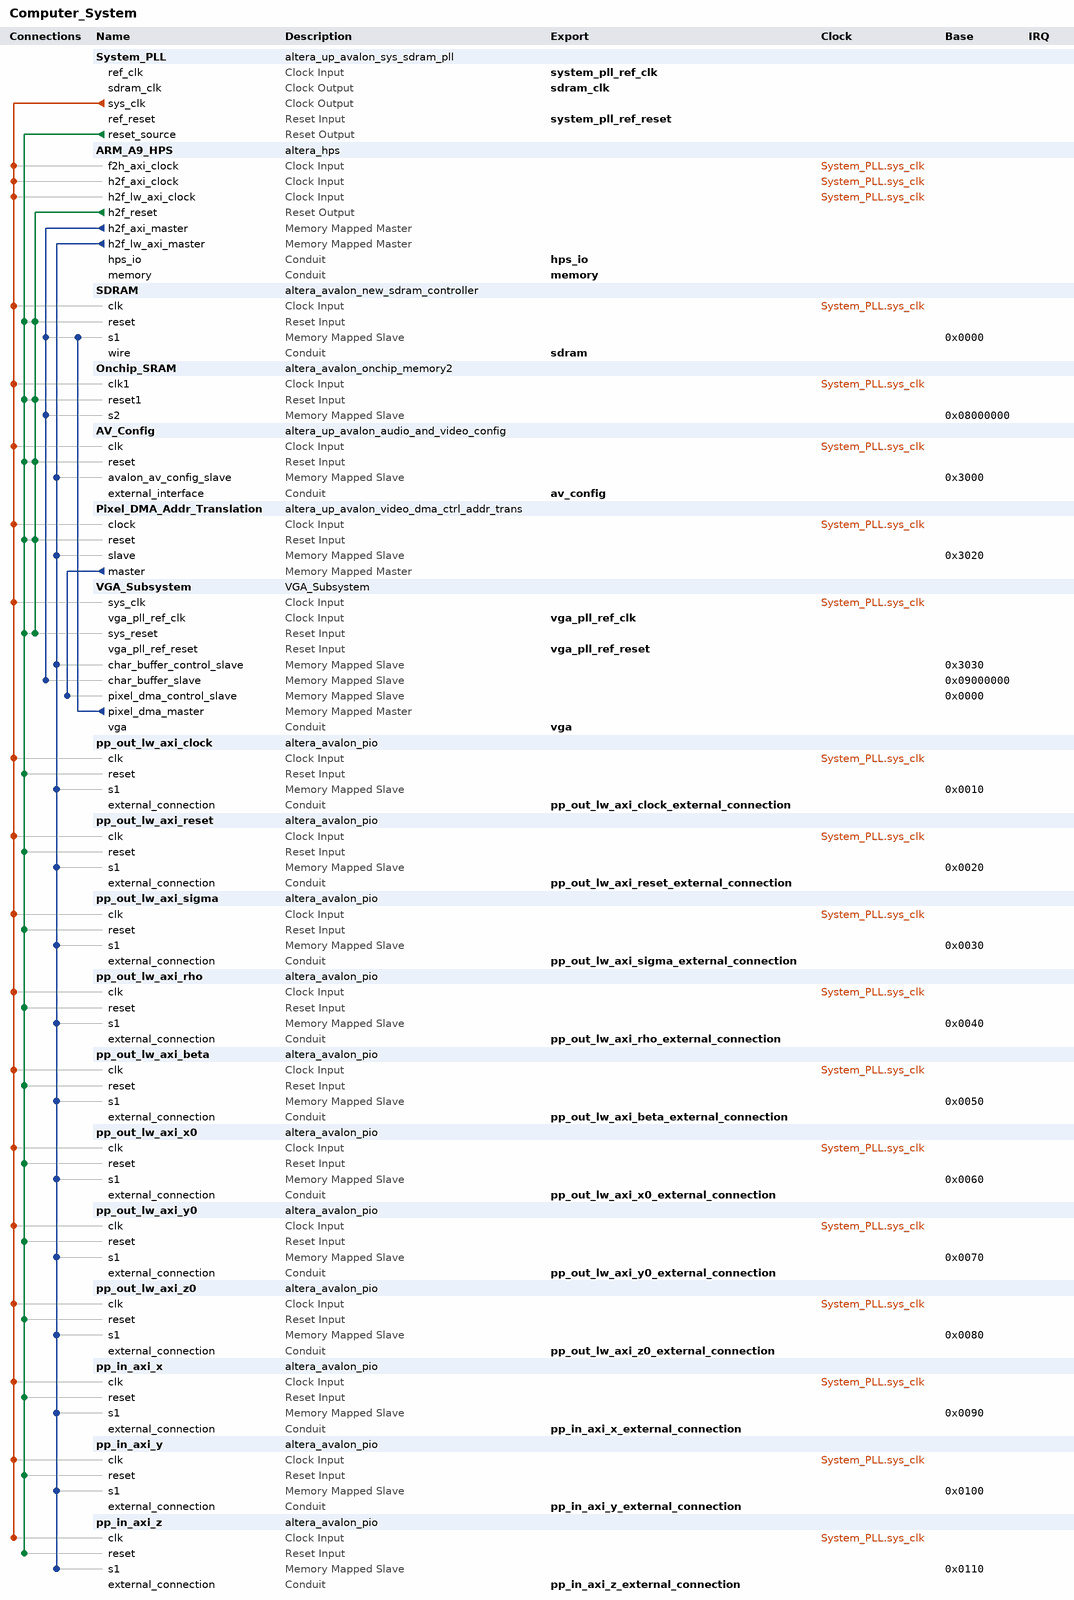
[diagram p0: system contents]
# Platform Designer (Qsys) system Computer_System, Cyclone V 5CSEMA5F31C6
# Parameters at their usual value, and those the tool derives, are not listed.
package require -exact qsys 18.1
create_system Computer_System
set_project_property DEVICE_FAMILY {Cyclone V}
set_project_property DEVICE 5CSEMA5F31C6

add_instance System_PLL altera_up_avalon_sys_sdram_pll 18.0
set_instance_parameter_value System_PLL CV_boards DE1-SoC
set_instance_parameter_value System_PLL gui_outclk 100.0
set_instance_parameter_value System_PLL gui_refclk 50.0

add_instance ARM_A9_HPS altera_hps 18.1
set_instance_parameter_value ARM_A9_HPS EMAC1_Mode RGMII
set_instance_parameter_value ARM_A9_HPS EMAC1_PinMuxing {HPS I/O Set 0}
set_instance_parameter_value ARM_A9_HPS F2SCLK_COLDRST_Enable false
set_instance_parameter_value ARM_A9_HPS F2SCLK_DBGRST_Enable false
set_instance_parameter_value ARM_A9_HPS F2SCLK_WARMRST_Enable false
set_instance_parameter_value ARM_A9_HPS F2SINTERRUPT_Enable true
set_instance_parameter_value ARM_A9_HPS F2S_Width 2
set_instance_parameter_value ARM_A9_HPS FPGA_PERIPHERAL_OUTPUT_CLOCK_FREQ_EMAC0_GTX_CLK 125
set_instance_parameter_value ARM_A9_HPS FPGA_PERIPHERAL_OUTPUT_CLOCK_FREQ_EMAC0_MD_CLK 100.0
set_instance_parameter_value ARM_A9_HPS FPGA_PERIPHERAL_OUTPUT_CLOCK_FREQ_EMAC1_GTX_CLK 125
set_instance_parameter_value ARM_A9_HPS FPGA_PERIPHERAL_OUTPUT_CLOCK_FREQ_EMAC1_MD_CLK 100.0
set_instance_parameter_value ARM_A9_HPS HPS_PROTOCOL DDR3
set_instance_parameter_value ARM_A9_HPS I2C0_Mode I2C
set_instance_parameter_value ARM_A9_HPS I2C0_PinMuxing {HPS I/O Set 0}
set_instance_parameter_value ARM_A9_HPS I2C1_Mode I2C
set_instance_parameter_value ARM_A9_HPS I2C1_PinMuxing {HPS I/O Set 0}
set_instance_parameter_value ARM_A9_HPS LWH2F_Enable true
set_instance_parameter_value ARM_A9_HPS MEM_BANKADDR_WIDTH 3
set_instance_parameter_value ARM_A9_HPS MEM_CLK_FREQ 400.0
set_instance_parameter_value ARM_A9_HPS MEM_COL_ADDR_WIDTH 10
set_instance_parameter_value ARM_A9_HPS MEM_DQ_WIDTH 32
set_instance_parameter_value ARM_A9_HPS MEM_DRV_STR RZQ/7
set_instance_parameter_value ARM_A9_HPS MEM_ROW_ADDR_WIDTH 15
set_instance_parameter_value ARM_A9_HPS MEM_RTT_NOM RZQ/4
set_instance_parameter_value ARM_A9_HPS MEM_RTT_WR RZQ/4
set_instance_parameter_value ARM_A9_HPS MEM_TCL 11
set_instance_parameter_value ARM_A9_HPS MEM_TFAW_NS 30.0
set_instance_parameter_value ARM_A9_HPS MEM_TRAS_NS 35.0
set_instance_parameter_value ARM_A9_HPS MEM_TRCD_NS 13.75
set_instance_parameter_value ARM_A9_HPS MEM_TRFC_NS 260.0
set_instance_parameter_value ARM_A9_HPS MEM_TRP_NS 13.75
set_instance_parameter_value ARM_A9_HPS MEM_VENDOR JEDEC
set_instance_parameter_value ARM_A9_HPS MEM_WTCL 8
set_instance_parameter_value ARM_A9_HPS QSPI_Mode {1 SS}
set_instance_parameter_value ARM_A9_HPS QSPI_PinMuxing {HPS I/O Set 0}
set_instance_parameter_value ARM_A9_HPS REF_CLK_FREQ 25.0
set_instance_parameter_value ARM_A9_HPS S2FCLK_USER2CLK 5
set_instance_parameter_value ARM_A9_HPS S2F_Width 3
set_instance_parameter_value ARM_A9_HPS SDIO_Mode {4-bit Data}
set_instance_parameter_value ARM_A9_HPS SDIO_PinMuxing {HPS I/O Set 0}
set_instance_parameter_value ARM_A9_HPS SPIM1_Mode {Single Slave Select}
set_instance_parameter_value ARM_A9_HPS SPIM1_PinMuxing {HPS I/O Set 0}
set_instance_parameter_value ARM_A9_HPS STM_Enable false
set_instance_parameter_value ARM_A9_HPS TIMING_BOARD_AC_SKEW 0.03
set_instance_parameter_value ARM_A9_HPS TIMING_BOARD_AC_TO_CK_SKEW 0.0
set_instance_parameter_value ARM_A9_HPS TIMING_BOARD_DQ_TO_DQS_SKEW 0.0
set_instance_parameter_value ARM_A9_HPS TIMING_BOARD_MAX_CK_DELAY 0.03
set_instance_parameter_value ARM_A9_HPS TIMING_BOARD_MAX_DQS_DELAY 0.02
set_instance_parameter_value ARM_A9_HPS TIMING_BOARD_SKEW_BETWEEN_DQS 0.08
set_instance_parameter_value ARM_A9_HPS TIMING_BOARD_SKEW_CKDQS_DIMM_MAX 0.16
set_instance_parameter_value ARM_A9_HPS TIMING_BOARD_SKEW_CKDQS_DIMM_MIN 0.09
set_instance_parameter_value ARM_A9_HPS TIMING_BOARD_SKEW_WITHIN_DQS 0.01
set_instance_parameter_value ARM_A9_HPS TIMING_TDH 65
set_instance_parameter_value ARM_A9_HPS TIMING_TDQSCK 255
set_instance_parameter_value ARM_A9_HPS TIMING_TDQSQ 125
set_instance_parameter_value ARM_A9_HPS TIMING_TDS 30
set_instance_parameter_value ARM_A9_HPS TIMING_TIH 140
set_instance_parameter_value ARM_A9_HPS TIMING_TIS 180
set_instance_parameter_value ARM_A9_HPS TIMING_TQSH 0.4
set_instance_parameter_value ARM_A9_HPS UART0_Mode {No Flow Control}
set_instance_parameter_value ARM_A9_HPS UART0_PinMuxing {HPS I/O Set 0}
set_instance_parameter_value ARM_A9_HPS USB1_Mode SDR
set_instance_parameter_value ARM_A9_HPS USB1_PinMuxing {HPS I/O Set 0}
set_instance_parameter_value ARM_A9_HPS desired_cfg_clk_mhz 100.0
set_instance_parameter_value ARM_A9_HPS desired_qspi_clk_mhz 400.0

add_instance SDRAM altera_avalon_new_sdram_controller 18.1
set_instance_parameter_value SDRAM TAC 5.5
set_instance_parameter_value SDRAM TRCD 20.0
set_instance_parameter_value SDRAM TRP 20.0
set_instance_parameter_value SDRAM casLatency 3
set_instance_parameter_value SDRAM columnWidth 10
set_instance_parameter_value SDRAM dataWidth 16
set_instance_parameter_value SDRAM generateSimulationModel true
set_instance_parameter_value SDRAM model single_Micron_MT48LC4M32B2_7_chip
set_instance_parameter_value SDRAM numberOfBanks 4
set_instance_parameter_value SDRAM numberOfChipSelects 1
set_instance_parameter_value SDRAM powerUpDelay 100.0
set_instance_parameter_value SDRAM refreshPeriod 15.625
set_instance_parameter_value SDRAM rowWidth 13

add_instance Onchip_SRAM altera_avalon_onchip_memory2 18.1
set_instance_parameter_value Onchip_SRAM dataWidth 8
set_instance_parameter_value Onchip_SRAM dualPort true
set_instance_parameter_value Onchip_SRAM initMemContent false
set_instance_parameter_value Onchip_SRAM initializationFileName onchip_mem.hex
set_instance_parameter_value Onchip_SRAM memorySize 131072
set_instance_parameter_value Onchip_SRAM singleClockOperation true

add_instance AV_Config altera_up_avalon_audio_and_video_config 18.0
set_instance_parameter_value AV_Config audio_in {Microphone to ADC}
set_instance_parameter_value AV_Config bit_length 32
set_instance_parameter_value AV_Config board DE1-SoC
set_instance_parameter_value AV_Config line_in_bypass false
set_instance_parameter_value AV_Config sampling_rate {48 kHz}

add_instance Pixel_DMA_Addr_Translation altera_up_avalon_video_dma_ctrl_addr_trans 18.0

add_instance VGA_Subsystem VGA_Subsystem 1.0

add_instance pp_out_lw_axi_clock altera_avalon_pio 18.1
set_instance_parameter_value pp_out_lw_axi_clock direction Output
set_instance_parameter_value pp_out_lw_axi_clock width 32

add_instance pp_out_lw_axi_reset altera_avalon_pio 18.1
set_instance_parameter_value pp_out_lw_axi_reset direction Output
set_instance_parameter_value pp_out_lw_axi_reset width 32

add_instance pp_out_lw_axi_sigma altera_avalon_pio 18.1
set_instance_parameter_value pp_out_lw_axi_sigma direction Output
set_instance_parameter_value pp_out_lw_axi_sigma width 32

add_instance pp_out_lw_axi_rho altera_avalon_pio 18.1
set_instance_parameter_value pp_out_lw_axi_rho direction Output
set_instance_parameter_value pp_out_lw_axi_rho width 32

add_instance pp_out_lw_axi_beta altera_avalon_pio 18.1
set_instance_parameter_value pp_out_lw_axi_beta direction Output
set_instance_parameter_value pp_out_lw_axi_beta width 32

add_instance pp_out_lw_axi_x0 altera_avalon_pio 18.1
set_instance_parameter_value pp_out_lw_axi_x0 direction Output
set_instance_parameter_value pp_out_lw_axi_x0 width 32

add_instance pp_out_lw_axi_y0 altera_avalon_pio 18.1
set_instance_parameter_value pp_out_lw_axi_y0 direction Output
set_instance_parameter_value pp_out_lw_axi_y0 width 32

add_instance pp_out_lw_axi_z0 altera_avalon_pio 18.1
set_instance_parameter_value pp_out_lw_axi_z0 direction Output
set_instance_parameter_value pp_out_lw_axi_z0 width 32

add_instance pp_in_axi_x altera_avalon_pio 18.1
set_instance_parameter_value pp_in_axi_x direction Input
set_instance_parameter_value pp_in_axi_x width 32

add_instance pp_in_axi_y altera_avalon_pio 18.1
set_instance_parameter_value pp_in_axi_y direction Input
set_instance_parameter_value pp_in_axi_y width 32

add_instance pp_in_axi_z altera_avalon_pio 18.1
set_instance_parameter_value pp_in_axi_z direction Input
set_instance_parameter_value pp_in_axi_z width 32

# connections
add_connection System_PLL.sys_clk ARM_A9_HPS.f2h_axi_clock clock
add_connection System_PLL.sys_clk ARM_A9_HPS.h2f_axi_clock clock
add_connection System_PLL.sys_clk ARM_A9_HPS.h2f_lw_axi_clock clock
add_connection System_PLL.sys_clk AV_Config.clk clock
add_connection System_PLL.sys_clk Onchip_SRAM.clk1 clock
add_connection System_PLL.sys_clk Pixel_DMA_Addr_Translation.clock clock
add_connection System_PLL.sys_clk pp_in_axi_x.clk clock
add_connection System_PLL.sys_clk pp_in_axi_y.clk clock
add_connection System_PLL.sys_clk pp_in_axi_z.clk clock
add_connection System_PLL.sys_clk pp_out_lw_axi_beta.clk clock
add_connection System_PLL.sys_clk pp_out_lw_axi_clock.clk clock
add_connection System_PLL.sys_clk pp_out_lw_axi_reset.clk clock
add_connection System_PLL.sys_clk pp_out_lw_axi_rho.clk clock
add_connection System_PLL.sys_clk pp_out_lw_axi_sigma.clk clock
add_connection System_PLL.sys_clk pp_out_lw_axi_x0.clk clock
add_connection System_PLL.sys_clk pp_out_lw_axi_y0.clk clock
add_connection System_PLL.sys_clk pp_out_lw_axi_z0.clk clock
add_connection System_PLL.sys_clk SDRAM.clk clock
add_connection System_PLL.sys_clk VGA_Subsystem.sys_clk clock
add_connection ARM_A9_HPS.h2f_reset AV_Config.reset reset
add_connection ARM_A9_HPS.h2f_reset Onchip_SRAM.reset1 reset
add_connection ARM_A9_HPS.h2f_reset Pixel_DMA_Addr_Translation.reset reset
add_connection ARM_A9_HPS.h2f_reset SDRAM.reset reset
add_connection ARM_A9_HPS.h2f_reset VGA_Subsystem.sys_reset reset
add_connection System_PLL.reset_source AV_Config.reset reset
add_connection System_PLL.reset_source Onchip_SRAM.reset1 reset
add_connection System_PLL.reset_source Pixel_DMA_Addr_Translation.reset reset
add_connection System_PLL.reset_source pp_in_axi_x.reset reset
add_connection System_PLL.reset_source pp_in_axi_y.reset reset
add_connection System_PLL.reset_source pp_in_axi_z.reset reset
add_connection System_PLL.reset_source pp_out_lw_axi_beta.reset reset
add_connection System_PLL.reset_source pp_out_lw_axi_clock.reset reset
add_connection System_PLL.reset_source pp_out_lw_axi_reset.reset reset
add_connection System_PLL.reset_source pp_out_lw_axi_rho.reset reset
add_connection System_PLL.reset_source pp_out_lw_axi_sigma.reset reset
add_connection System_PLL.reset_source pp_out_lw_axi_x0.reset reset
add_connection System_PLL.reset_source pp_out_lw_axi_y0.reset reset
add_connection System_PLL.reset_source pp_out_lw_axi_z0.reset reset
add_connection System_PLL.reset_source SDRAM.reset reset
add_connection System_PLL.reset_source VGA_Subsystem.sys_reset reset
add_connection ARM_A9_HPS.h2f_axi_master Onchip_SRAM.s2 avalon
set_connection_parameter_value ARM_A9_HPS.h2f_axi_master/Onchip_SRAM.s2 baseAddress 0x08000000
add_connection ARM_A9_HPS.h2f_axi_master SDRAM.s1 avalon
set_connection_parameter_value ARM_A9_HPS.h2f_axi_master/SDRAM.s1 baseAddress 0x0000
add_connection ARM_A9_HPS.h2f_axi_master VGA_Subsystem.char_buffer_slave avalon
set_connection_parameter_value ARM_A9_HPS.h2f_axi_master/VGA_Subsystem.char_buffer_slave baseAddress 0x09000000
add_connection ARM_A9_HPS.h2f_lw_axi_master AV_Config.avalon_av_config_slave avalon
set_connection_parameter_value ARM_A9_HPS.h2f_lw_axi_master/AV_Config.avalon_av_config_slave baseAddress 0x3000
add_connection ARM_A9_HPS.h2f_lw_axi_master Pixel_DMA_Addr_Translation.slave avalon
set_connection_parameter_value ARM_A9_HPS.h2f_lw_axi_master/Pixel_DMA_Addr_Translation.slave baseAddress 0x3020
add_connection ARM_A9_HPS.h2f_lw_axi_master pp_in_axi_x.s1 avalon
set_connection_parameter_value ARM_A9_HPS.h2f_lw_axi_master/pp_in_axi_x.s1 baseAddress 0x0090
add_connection ARM_A9_HPS.h2f_lw_axi_master pp_in_axi_y.s1 avalon
set_connection_parameter_value ARM_A9_HPS.h2f_lw_axi_master/pp_in_axi_y.s1 baseAddress 0x0100
add_connection ARM_A9_HPS.h2f_lw_axi_master pp_in_axi_z.s1 avalon
set_connection_parameter_value ARM_A9_HPS.h2f_lw_axi_master/pp_in_axi_z.s1 baseAddress 0x0110
add_connection ARM_A9_HPS.h2f_lw_axi_master pp_out_lw_axi_beta.s1 avalon
set_connection_parameter_value ARM_A9_HPS.h2f_lw_axi_master/pp_out_lw_axi_beta.s1 baseAddress 0x0050
add_connection ARM_A9_HPS.h2f_lw_axi_master pp_out_lw_axi_clock.s1 avalon
set_connection_parameter_value ARM_A9_HPS.h2f_lw_axi_master/pp_out_lw_axi_clock.s1 baseAddress 0x0010
add_connection ARM_A9_HPS.h2f_lw_axi_master pp_out_lw_axi_reset.s1 avalon
set_connection_parameter_value ARM_A9_HPS.h2f_lw_axi_master/pp_out_lw_axi_reset.s1 baseAddress 0x0020
add_connection ARM_A9_HPS.h2f_lw_axi_master pp_out_lw_axi_rho.s1 avalon
set_connection_parameter_value ARM_A9_HPS.h2f_lw_axi_master/pp_out_lw_axi_rho.s1 baseAddress 0x0040
add_connection ARM_A9_HPS.h2f_lw_axi_master pp_out_lw_axi_sigma.s1 avalon
set_connection_parameter_value ARM_A9_HPS.h2f_lw_axi_master/pp_out_lw_axi_sigma.s1 baseAddress 0x0030
add_connection ARM_A9_HPS.h2f_lw_axi_master pp_out_lw_axi_x0.s1 avalon
set_connection_parameter_value ARM_A9_HPS.h2f_lw_axi_master/pp_out_lw_axi_x0.s1 baseAddress 0x0060
add_connection ARM_A9_HPS.h2f_lw_axi_master pp_out_lw_axi_y0.s1 avalon
set_connection_parameter_value ARM_A9_HPS.h2f_lw_axi_master/pp_out_lw_axi_y0.s1 baseAddress 0x0070
add_connection ARM_A9_HPS.h2f_lw_axi_master pp_out_lw_axi_z0.s1 avalon
set_connection_parameter_value ARM_A9_HPS.h2f_lw_axi_master/pp_out_lw_axi_z0.s1 baseAddress 0x0080
add_connection ARM_A9_HPS.h2f_lw_axi_master VGA_Subsystem.char_buffer_control_slave avalon
set_connection_parameter_value ARM_A9_HPS.h2f_lw_axi_master/VGA_Subsystem.char_buffer_control_slave baseAddress 0x3030
add_connection Pixel_DMA_Addr_Translation.master VGA_Subsystem.pixel_dma_control_slave avalon
set_connection_parameter_value Pixel_DMA_Addr_Translation.master/VGA_Subsystem.pixel_dma_control_slave baseAddress 0x0000
add_connection VGA_Subsystem.pixel_dma_master SDRAM.s1 avalon
set_connection_parameter_value VGA_Subsystem.pixel_dma_master/SDRAM.s1 baseAddress 0x0000

# exported interfaces
add_interface av_config conduit end
set_interface_property av_config EXPORT_OF AV_Config.external_interface
add_interface hps_io conduit end
set_interface_property hps_io EXPORT_OF ARM_A9_HPS.hps_io
add_interface memory conduit end
set_interface_property memory EXPORT_OF ARM_A9_HPS.memory
add_interface pp_in_axi_x_external_connection conduit end
set_interface_property pp_in_axi_x_external_connection EXPORT_OF pp_in_axi_x.external_connection
add_interface pp_in_axi_y_external_connection conduit end
set_interface_property pp_in_axi_y_external_connection EXPORT_OF pp_in_axi_y.external_connection
add_interface pp_in_axi_z_external_connection conduit end
set_interface_property pp_in_axi_z_external_connection EXPORT_OF pp_in_axi_z.external_connection
add_interface pp_out_lw_axi_beta_external_connection conduit end
set_interface_property pp_out_lw_axi_beta_external_connection EXPORT_OF pp_out_lw_axi_beta.external_connection
add_interface pp_out_lw_axi_clock_external_connection conduit end
set_interface_property pp_out_lw_axi_clock_external_connection EXPORT_OF pp_out_lw_axi_clock.external_connection
add_interface pp_out_lw_axi_reset_external_connection conduit end
set_interface_property pp_out_lw_axi_reset_external_connection EXPORT_OF pp_out_lw_axi_reset.external_connection
add_interface pp_out_lw_axi_rho_external_connection conduit end
set_interface_property pp_out_lw_axi_rho_external_connection EXPORT_OF pp_out_lw_axi_rho.external_connection
add_interface pp_out_lw_axi_sigma_external_connection conduit end
set_interface_property pp_out_lw_axi_sigma_external_connection EXPORT_OF pp_out_lw_axi_sigma.external_connection
add_interface pp_out_lw_axi_x0_external_connection conduit end
set_interface_property pp_out_lw_axi_x0_external_connection EXPORT_OF pp_out_lw_axi_x0.external_connection
add_interface pp_out_lw_axi_y0_external_connection conduit end
set_interface_property pp_out_lw_axi_y0_external_connection EXPORT_OF pp_out_lw_axi_y0.external_connection
add_interface pp_out_lw_axi_z0_external_connection conduit end
set_interface_property pp_out_lw_axi_z0_external_connection EXPORT_OF pp_out_lw_axi_z0.external_connection
add_interface sdram conduit end
set_interface_property sdram EXPORT_OF SDRAM.wire
add_interface sdram_clk clock source
set_interface_property sdram_clk EXPORT_OF System_PLL.sdram_clk
add_interface system_pll_ref_clk clock sink
set_interface_property system_pll_ref_clk EXPORT_OF System_PLL.ref_clk
add_interface system_pll_ref_reset reset sink
set_interface_property system_pll_ref_reset EXPORT_OF System_PLL.ref_reset
add_interface vga conduit end
set_interface_property vga EXPORT_OF VGA_Subsystem.vga
add_interface vga_pll_ref_clk clock sink
set_interface_property vga_pll_ref_clk EXPORT_OF VGA_Subsystem.vga_pll_ref_clk
add_interface vga_pll_ref_reset reset sink
set_interface_property vga_pll_ref_reset EXPORT_OF VGA_Subsystem.vga_pll_ref_reset

set_interconnect_requirement {$system} qsys_mm.clockCrossingAdapter HANDSHAKE
set_interconnect_requirement {$system} qsys_mm.enableEccProtection FALSE
set_interconnect_requirement {$system} qsys_mm.insertDefaultSlave FALSE
set_interconnect_requirement {$system} qsys_mm.maxAdditionalLatency 1

save_system Computer_System.qsys
